# EAGLE design AT42QT1010_Capacitive_Touch_Breakout (EAGLE 7.7.0)
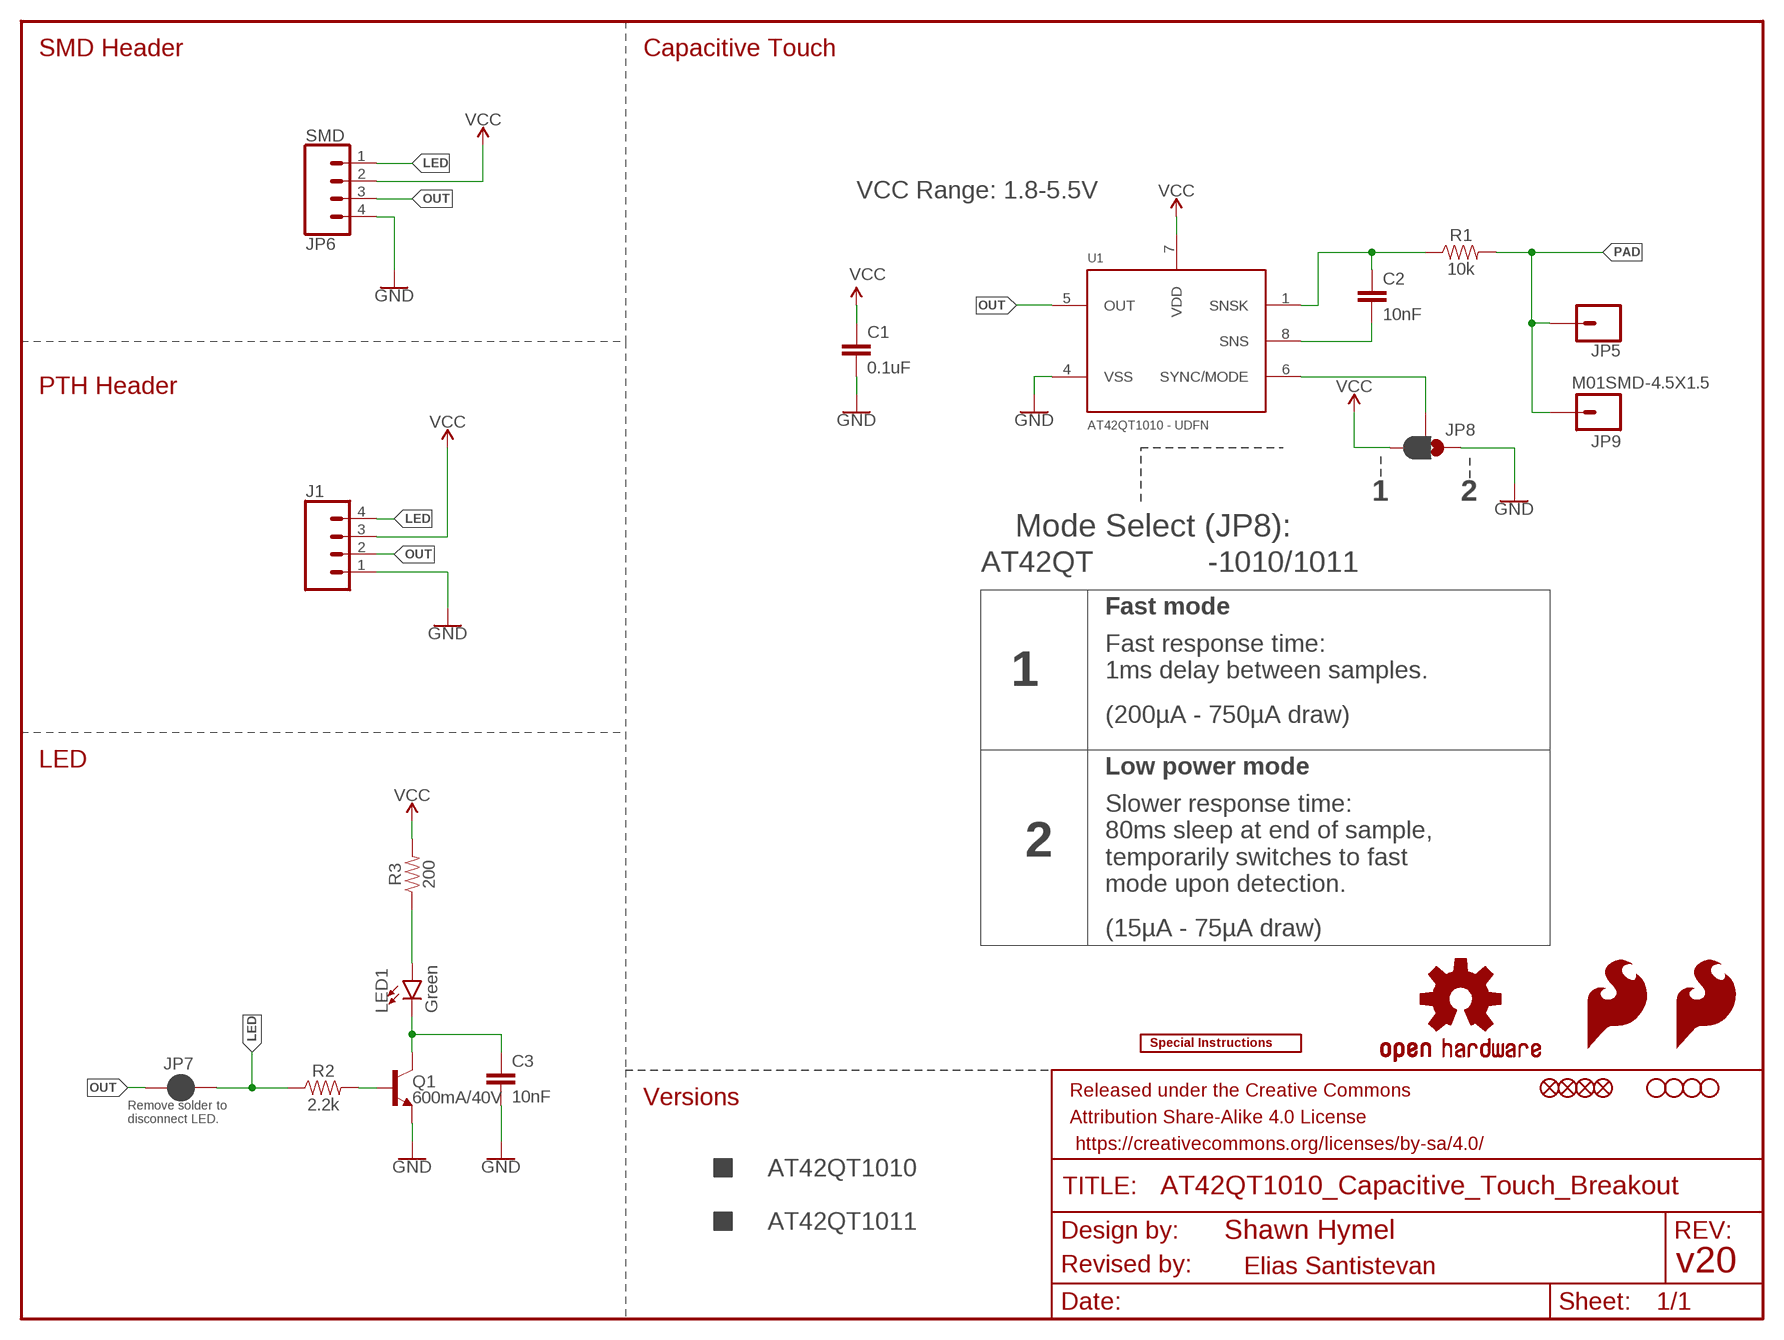
[diagram p0: schematic, sheet 1]

## Parts
C1  0.1uF  0.1UF-0603-25V-(+80/-20%)  [0603]
C2  10nF  10NF-0603-50V-10%  [0603]
C3  10nF  10NF-0603-50V-10%  [0603]
FID1  FIDUCIAL1X2  [FIDUCIAL-1X2]
FID2  FIDUCIAL1X2  [FIDUCIAL-1X2]
FID3  FIDUCIAL1X2  [FIDUCIAL-1X2]
FID4  FIDUCIAL1X2  [FIDUCIAL-1X2]
FRAME1  FRAME-LETTER  [CREATIVE_COMMONS]
J1  CONN_04  [1X04]
JP5  CONN_01  [1X01]
JP6  SMD  CONN_04SMD  [1X04_SMD_RA_MALE]
JP7  JUMPER-SMT_2_NC_PASTE_SILK  [SMT-JUMPER_2_NC_PASTE_SILK]
JP8  JUMPER-SMT_3_1-NC_PASTE_SILK  [SMT-JUMPER_3_1-NC_PASTE_SILK]
JP9  M01SMD-4.5X1.5  [PAD-1.5X4.5]
LED1  Green  LED-GREEN1206-BOTTOM  [LED-1206-BOTTOM]
LOGO1  SFE_LOGO_FLAME.2_INCH  [SFE_LOGO_FLAME_.2]
LOGO2  OSHW-LOGOS  [OSHW-LOGO-S]
LOGO4  SFE_LOGO_FLAME.2_INCH  [SFE_LOGO_FLAME_.2]
Q1  600mA/40V  TRANS_NPN-MMBT2222AL  [SOT23-3]
R1  10k  10KOHM-0603-1/10W-1%  [0603]
R2  2.2k  2.2KOHM-0603-1/10W-1%  [0603]
R3  200  200OHM-0603-1/10W-1%  [0603]
STANDOFF1  STAND-OFF  [STAND-OFF]
STANDOFF2  STAND-OFF  [STAND-OFF]
STANDOFF3  STAND-OFF  [STAND-OFF]
STANDOFF4  STAND-OFF  [STAND-OFF]
U1  AT42QT1010 - UDFN  AT42QT1010UDFN  [UDFN/USON_8_PAD]
U$1  SPECIAL_INSTRUCTIONS-ORDERING  [ORDERING_INSTRUCTIONS]

## Nets
GND: C1.2 C3.2 J1.1 JP6.4 JP8.1 Q1.2(E) U1.4(VSS)
LED: J1.4 JP6.1 JP7.2 R2.1
N$3: JP8.2 U1.6(SYNC/MODE)
N$4: C2.2 U1.8(SNS)
N$5: C2.1 R1.1 U1.1(SNSK)
N$10: Q1.1(B) R2.2
N$11: C3.1 LED1.C Q1.3(C)
N$12: LED1.A R3.1
OUT: J1.2 JP6.3 JP7.1 U1.5(OUT)
PAD: JP5.1 JP9.P$1 R1.2
VCC: C1.1 J1.3 JP6.2 JP8.3 R3.2 U1.7(VDD)

## Notes on the sheet
- SMD Header | Capacitive Touch
- VCC Range: 1.8-5.5V
- PTH Header
- 1 | 2
- Mode Select (JP8):
- AT42QT | -1010/1011
- Fast mode
- Fast response time:
  1ms delay between samples.
- 1
- (200µA - 750µA draw)
- LED | Low power mode
- 2
- Slower response time:
  80ms sleep at end of sample,
  temporarily switches to fast 
  mode upon detection.
- (15µA - 75µA draw)
- Versions
- Remove solder to 
  disconnect LED.
- AT42QT1010
- AT42QT1011
- Shawn Hymel
- Revised by: | Elias Santistevan | v20

## Library data of the parts
C1 = SparkFun-Capacitors:0.1UF: 0.1µF ceramic capacitors A capacitor is a passive two-terminal electrical component used to store electrical energy temporarily in an electric field.; PROD_ID: CAP-00810
C2 C3 = SparkFun-Capacitors:10NF: 0.01uF/10nF/10,000pF ceramic capacitors A capacitor is a passive two-terminal electrical component used to store electrical energy temporarily in an electric field. CAP-09321; PROD_ID: CAP-00867
FID1-FID4 = SparkFun-Aesthetics:FIDUCIAL: Fiducial Alignment Points Various fiducial points for machine vision alignment.
FRAME1 = SparkFun-Aesthetics:FRAME-LETTER: Schematic Frame - Letter Standard 8.5x11 US Letter frame
J1 = SparkFun-Connectors:CONN_04: Multi connection point. Often used as Generic Header-pin footprint for 0.1 inch spaced/style header connections On any of the 0.1 inch spaced packages, you can populate with these: Break Away Headers - Straight <https://www.sparkfun.com/products/116> (PRT-00116) Break Away Male Headers - Right Angle <https://www.sparkfun.com/products/553> (PRT-00553) Female Headers <https://www.sparkfun.com/products/115> (PRT-00115) Break Away Headers - Machine Pin <https://www.sparkfun.com/products/117> (PRT-00117) Break Away Female Headers - Swiss Machine Pin <https://www.sparkfun.com/products/743> (PRT-00743) For SCREWTERMINALS and SPRING TERMINALS visit here: Screw Terimnals on SparkFun.com <https://www.sparkfun.com/search/results?term=Screw+Terminals> (5mm/3.5mm/2.54mm spacing) This device is also useful as a general connection point to wire up your design to another part of your project. Our various solder wires solder well into these plated through hole pads. Hook-Up Wire - Assortment (Stranded, 22 AWG) <https://www.sparkfun.com/products/11375> (PRT-11375) Hook-Up Wire - Assortment (Solid Core, 22 AWG) <https://www.sparkfun.com/products/11367> (PRT-11367) View the entire wire category on our website here <https://www.sparkfun.com/categories/141> Special notes: Molex polarized connector foot print use with SKU : PRT-08231 with associated crimp pins and housings. 1MM SMD Version SKU: PRT-10208; PROD_ID: CONN-09696
JP5 = SparkFun-Connectors:CONN_01: Single connection point. Often used as Generic Header-pin footprint for 0.1 inch spaced/style header connections On any of the 0.1 inch spaced packages, you can populate with these: Break Away Headers - Straight <https://www.sparkfun.com/products/116> (PRT-00116) Break Away Male Headers - Right Angle <https://www.sparkfun.com/products/553> (PRT-00553) Female Headers <https://www.sparkfun.com/products/115> (PRT-00115) Break Away Headers - Machine Pin <https://www.sparkfun.com/products/117> (PRT-00117) Break Away Female Headers - Swiss Machine Pin <https://www.sparkfun.com/products/743> (PRT-00743) This device is also useful as a general connection point to wire up your design to another part of your project. Our various solder wires solder well into these plated through hole pads. Hook-Up Wire - Assortment (Stranded, 22 AWG) <https://www.sparkfun.com/products/11375> (PRT-11375) Hook-Up Wire - Assortment (Solid Core, 22 AWG) <https://www.sparkfun.com/products/11367> (PRT-11367) View the entire wire category on our website here <https://www.sparkfun.com/categories/141> Special notes: SMTSO-256-ET is a "flush mount" nut for a 4-40 screw. We mostly use this on specialty testbeds; it is a nice way to connect hardware to your PCB at an adjustable hieght. Also note, the SNAP packages are for using a snappable style connector. We sell a baggie of snaps and they are also used on two LilyPad designs: Snap Assortment - 30 pack (male and female) <https://www.sparkfun.com/products/11347> (DEV-11347) LilyPad Arduino SimpleSnap <https://www.sparkfun.com/products/10941> (DEV-10941) LilyPad SimpleSnap Protoboard <https://www.sparkfun.com/products/10940> (DEV-10940)
JP6 = SparkFun-Connectors:CONN_04: Multi connection point. Often used as Generic Header-pin footprint for 0.1 inch spaced/style header connections On any of the 0.1 inch spaced packages, you can populate with these: Break Away Headers - Straight <https://www.sparkfun.com/products/116> (PRT-00116) Break Away Male Headers - Right Angle <https://www.sparkfun.com/products/553> (PRT-00553) Female Headers <https://www.sparkfun.com/products/115> (PRT-00115) Break Away Headers - Machine Pin <https://www.sparkfun.com/products/117> (PRT-00117) Break Away Female Headers - Swiss Machine Pin <https://www.sparkfun.com/products/743> (PRT-00743) For SCREWTERMINALS and SPRING TERMINALS visit here: Screw Terimnals on SparkFun.com <https://www.sparkfun.com/search/results?term=Screw+Terminals> (5mm/3.5mm/2.54mm spacing) This device is also useful as a general connection point to wire up your design to another part of your project. Our various solder wires solder well into these plated through hole pads. Hook-Up Wire - Assortment (Stranded, 22 AWG) <https://www.sparkfun.com/products/11375> (PRT-11375) Hook-Up Wire - Assortment (Solid Core, 22 AWG) <https://www.sparkfun.com/products/11367> (PRT-11367) View the entire wire category on our website here <https://www.sparkfun.com/categories/141> Special notes: Molex polarized connector foot print use with SKU : PRT-08231 with associated crimp pins and housings. 1MM SMD Version SKU: PRT-10208; PROD_ID: CONN-09140; SF_ID: PRT-12638
JP7 = SparkFun-Jumpers:JUMPER-SMT_2_NC_PASTE: Normally closed solder jumper This jumper has an aperture in the stencil to allow solder paste to bridge the split in the wire so it's normally closed (NC). Wick off the solder to open the connection. Reapply solder to reclose the connection.
JP8 = SparkFun-Jumpers:JUMPER-SMT_3_1-NC_PASTE: Normally closed solder jumper (1 of 2 connections) This jumper has an aperture in the stencil to allow solder paste to bridge one of the two connections. One connection is normally closed (NC), while the other is normally open (NO). Wick off the solder to open the connection. Reapply solder to reclose the connection. Apply solder to the other side instead to change the current path.
JP9 = SparkFun-Connectors:M01: Header 1 Standard 1-pin 0.1" header. Use with straight break away headers (SKU : PRT-00116), right angle break away headers (PRT-00553), swiss pins (PRT-00743), machine pins (PRT-00117), and female headers (PRT-00115).
LED1 = SparkFun-LED:LED-GREEN: Green SMD LED Used in manufacturing of various products at SparkFun Packages: 0603 - SMD 0603 package [Product Link] <http://www.futureelectronics.com/en/technologies/semiconductors/optoelectronics/leds/Pages/9894312-LTST-C190GKT.aspx?CrossPart=HSMG-C190&IM=0> LilyPad 1206 - SMD1206 LilyPad package [Product Link] <http://www.futureelectronics.com/en/Technologies/Product.aspx?ProductID=IN150NGHARVATEKCORPORATION2049943&IM=0> 1206 - SMD1206 package [Product Link] <http://www.futureelectronics.com/en/technologies/semiconductors/optoelectronics/leds/Pages/8315665-LTST-C150KGKT.aspx?IM=0> 1206 Bottom Mount -SMD 1206 Bottom Mount [Product Link] <http://www.digikey.com/product-detail/en/lite-on-inc/LTST-C230KGKT/160-1456-1-ND/386854> SparkFun Products: Pro Mini 328 -5V <https://www.sparkfun.com/products/821> RedBoard <https://www.sparkfun.com/products/12757> MP3 Trigger <https://www.sparkfun.com/products/13720> Makey Makey <https://www.sparkfun.com/products/11076>; PROD_ID: DIO-11076
LOGO1 LOGO4 = SparkFun-Aesthetics:SFE_LOGO_FLAME: SparkFun Flame Logo This is the SparkFun flame logo. The logo on the schematic will always be the same size; the package variant is the height of the flame. Default layer for the logo on the board is tSilk.
LOGO2 = SparkFun-Aesthetics:OSHW-LOGO: Open Source Hardware Logo This logo indicates the piece of hardware it is found on incorporates a OSHW license and/or adheres to the definition of open source hardware found here: http://freedomdefined.org/OSHW
Q1 = SparkFun-DiscreteSemi:TRANS_NPN: NPN transistor Current controlled devices typically used to amplify current or used as a switch. BC547 - COM-08928 <http://www.sparkfun.com/products/8928> (TO-92 45V 100mA) (1.Collector 2.Base 3.Emitter) 2N3904 - COM-00521 <http://www.sparkfun.com/products/521> (TO-92 40V 200mA) (1.Emitter 2.Base 3.Collector) P2N2222A - COM-12852 <http://www.sparkfun.com/products/12852> (TO-92 40V 600mA) (1.Collector 2.Base 3.Emitter); PROD_ID: TRANS-08049
R1 = SparkFun-Resistors:10KOHM: 10kΩ resistor A resistor is a passive two-terminal electrical component that implements electrical resistance as a circuit element. Resistors act to reduce current flow, and, at the same time, act to lower voltage levels within circuits. - Wikipedia; PROD_ID: RES-00824
R2 = SparkFun-Resistors:2.2KOHM: 2.2kΩ resistor A resistor is a passive two-terminal electrical component that implements electrical resistance as a circuit element. Resistors act to reduce current flow, and, at the same time, act to lower voltage levels within circuits. - Wikipedia; PROD_ID: RES-08272
R3 = SparkFun-Resistors:200OHM: 200Ω resistor A resistor is a passive two-terminal electrical component that implements electrical resistance as a circuit element. Resistors act to reduce current flow, and, at the same time, act to lower voltage levels within circuits. - Wikipedia; PROD_ID: RES-08220
STANDOFF1-STANDOFF4 = SparkFun-Hardware:STAND-OFF: Stand Off Drill holes for mechanically mounting via screws, standoffs, etc. Note: Use the keepout ring to avoid running the screw head into surrounding components. Variant Overviews STAND-OFF - Mechanical footprint for a #4 phillips button head screw. STAND-OFF-TIGHT - Mechanical footprint for a #4 phillips button head screw, Example SparkFun Products Screw - Phillips Head (1/4", 4-40, 10 pack) <https://www.sparkfun.com/products/10453> (PRT-10453) Screw - Phillips Head (1/2", 4-40, 10 pack) <https://www.sparkfun.com/products/10452> (PRT-10452) Screw - Phillips Head (3/4", 4-40, 10 pack) <https://www.sparkfun.com/products/10451> (PRT-10451) Screw - Phillips Head (1", 4-40, 10 pack) <https://www.sparkfun.com/products/10450> (PRT-10450)
U1 = local_parts:AT42QT1010: Atmel AT42QT1010 The AT42QT1010 (QT1010) is a digital burst mode charge-transfer (QT™) sensor that is capable of detecting nearproximityor touch, making it ideal for implementing touch controls.The QT1010 is designed specifically for human interfaces, like control panels, appliances, toys, lighting controls, or anywhere a mechanical switch or button may be found. It includes all hardware and signal processing functions necessary to provide stable sensing under a wide variety of changing conditions. Only a single low-cost capacitor is required for operation. This chip is identical to the AT42QT1011, however the capsense times out after 60 seconds. Reciprocally, the capsense on the 1011 never times out. Reference "Signal Processing" in the datasheet. Datasheet <http://www.atmel.com/images/Atmel-9541-AT42-QTouch-BSW-AT42QT1010_Datasheet.pdf> Sparkfun Products Sparkfun Capacitive Touch Breakout <https://www.sparkfun.com/products/12041> (SEN-12041); PROD_ID: IC-13773
U$1 = SparkFun-Aesthetics:SPECIAL_INSTRUCTIONS: Special Ordering/Production Instructions Alert Symbol for special PCB ordering instructions or unique production process warnings. Ordering Instructions Production Instructions Types of information that should be added to box: Copper weight Soldermask color Silk color PCB thickness Number of layers PCB Standard: 1.6mm FR4 1 oz copper immersion silver plating red soldermask white silkscreen Types of information that should be added to box: Special wash requirements Depaneling instructions Humidification Glue curing Default text settings: 0.07 inch 9% ratio 50% line distance

## Net classes
0 default: clearance 0.205 mm

## Board
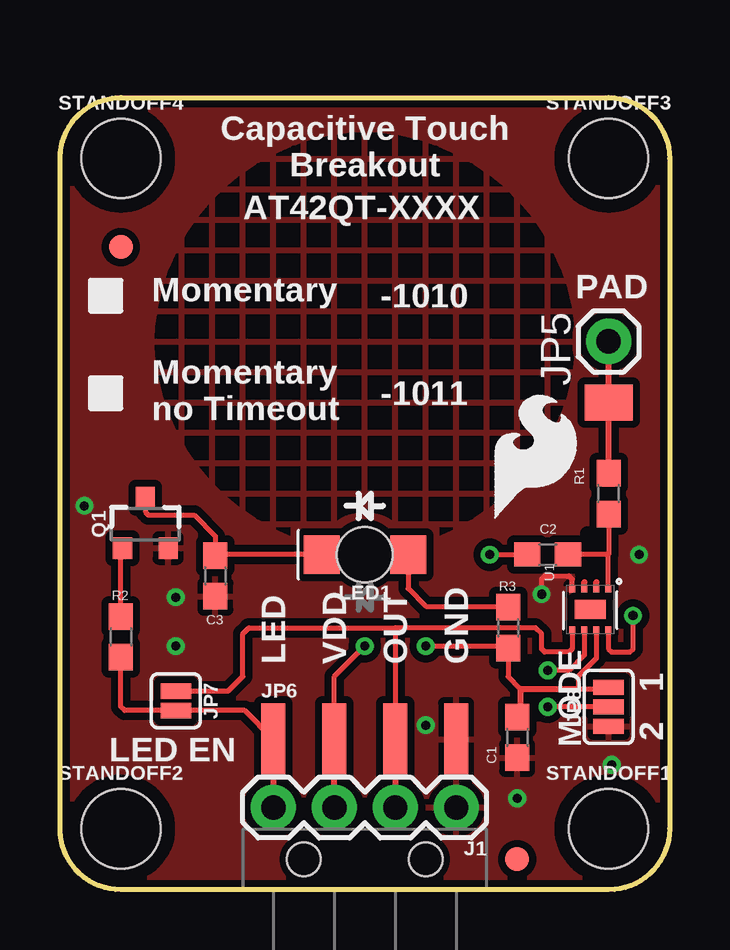
[diagram p1: board, top side]
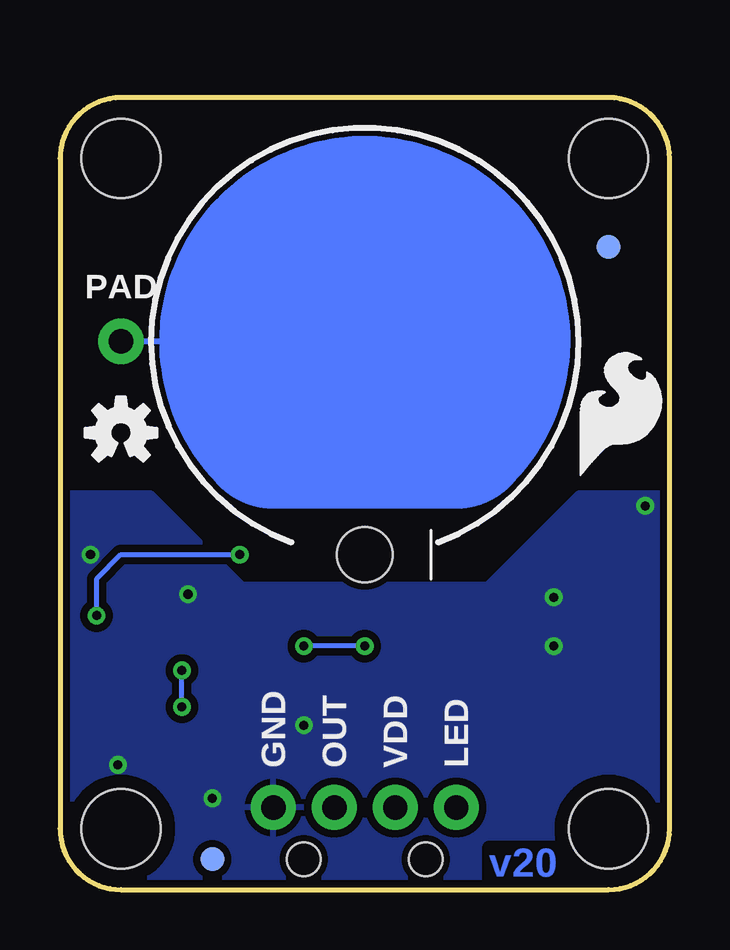
[diagram p2: board, bottom side, seen from below]

Size 25.4 x 33.02 mm. Coordinates in mm from the lower left corner, seen from the top.
Outline: 0,2.54 0,30.48 arc-90 2.54,33.02 22.86,33.02 arc-90 25.4,30.48 25.4,2.54 arc-90 22.86,0 2.54,0 arc-90 0,2.54
Copper layers (1*16): Top 0.035mm / dielectric 1.5mm / Bottom 0.035mm
Design rules "SparkFun-2-layer-TIGHT": minimum track width 7mil, minimum drill 15mil, track to track 7mil, track to pad 7mil, pad to pad 7mil, via to via 7mil, smd to smd 7mil, copper to edge 7mil, drill to drill 7mil, minimum pad ring 7mil, minimum via ring 7mil, stop-mask expansion 4mil, vias tented up to drill 25mil, thermal gap 10mil
tRestrict: area 0,0 to 2.5,2.5; area 22.9,0 to 25.4,2.5; area 0,30.5 to 2.5,33; area 22.9,30.5 to 25.4,33; area 15,2.3 to 15.5,2.8; area 9.9,2.3 to 10.4,2.8; area 11.2,0.5 to 14.2,2; area 12.4,2.3 to 13,2.8; area 19.4,9 to 19.8,9.5; area 22.1,13.1 to 22.5,13.6; area 22,14.4 to 22.4,14.9

### Footprints (pad centres in the part's own frame; a part is rotated, then mirrored left to right if it is on the bottom)
0603 = smd 1.1 x 1: 1 -0.85,0; 2 0.85,0
FIDUCIAL-1X2 = smd 1 x 1: 1 0,0
1X04 = drill 1.016 pad 1.88: 1 0,0; 2 2.54,0; 3 5.08,0; 4 7.62,0
1X01 = drill 1.016 pad 1.88: 1 0,0
1X04_SMD_RA_MALE = smd 1 x 3: 1 -3.81,5; 2 -1.27,5; 3 1.27,5; 4 3.81,5 | hole 1.4: -2.54,0; 2.54,0
SMT-JUMPER_2_NC_PASTE_SILK = smd 0.635 x 1.27: 1 -0.406,0; 2 0.406,0
SMT-JUMPER_3_1-NC_PASTE_SILK = smd 0.635 x 1.27: 1 -0.813,0; 2 0,0; 3 0.813,0
PAD-1.5X4.5 = smd 1.5 x 2: P$1 0,0
LED-1206-BOTTOM = smd 1.5 x 1.6: A -1.8,0; C 1.8,0 | hole 2.3: 0,0
SOT23-3 = smd 0.8 x 0.9: 1 -0.95,-1; 2 0.95,-1; 3 0,1.1
STAND-OFF = hole 3.302: 0,0
UDFN/USON_8_PAD = smd 0.25 x 0.3: 1 -0.75,-0.852; 2 -0.25,-0.852; 3 0.25,-0.852; 4 0.75,-0.852; 5 0.75,0.852; 6 0.25,0.852; 7 -0.25,0.852; 8 -0.75,0.852 | smd 1.3 x 0.8: P$1 0,0

### Placement (x,y rotation side)
C1  19.05,6.35 270 top
C2  20.32,13.97 180 top
C3  6.48,13.08 270 top
FID1  2.54,26.8 0 top
FID2  19.05,1.27 0 top
FID3  19.05,1.27 0 bottom
FID4  2.54,26.8 0 bottom
FRAME1  -15.24,-17.78 0 top  (outside the outline)
J1  16.51,3.43 180 top
JP5  22.86,22.86 0 top
JP6  12.7,1.27 0 top
JP7  4.83,7.87 270 top
JP8  22.86,7.62 90 top
JP9  22.86,20.32 90 top
LED1  12.7,13.97 180 top
LOGO1  17.78,15.24 0 top
LOGO2  22.86,19.05 0 bottom
LOGO4  4.06,17.02 0 bottom
Q1  3.56,15.24 0 top
R1  22.86,16.51 90 top
R2  2.54,10.54 90 top
R3  18.67,10.92 270 top
STANDOFF1  22.86,2.54 0 top
STANDOFF2  2.54,2.54 0 top
STANDOFF3  22.86,30.48 0 top
STANDOFF4  2.54,30.48 0 top
U1  22.1,11.68 180 top
U$1  -35.56,-21.59 0 top  (outside the outline)

### Tracks (layer width: path | path; a pad name or v marks a point on that pad's centre or on a via)
GND  (via drill 0.38)
  Top 0.203: U1.4 21.35,12.94 21.21,13.08 20.19,13.08 20.07,12.95 v20.07,12.32
  other vias: 19.05,3.81 1.02,16 24.13,13.97 4.83,12.19 4.83,10.16 22.99,5.21 15.24,6.86
  pour Bottom (isolate 0.305): 0,0 0,16.51 3.81,16.51 7.62,12.7 17.78,12.7 21.59,16.51 25.4,16.51 25.4,0
  pour Top (isolate 0.305): 0,0 25.4,0 25.4,22.86 21.59,22.86 arc-90 12.7,13.97 arc-90 3.81,22.86 0,22.86
  pour Top (isolate 0.305, hatched): 3.81,22.86 arc-90 12.7,31.75 arc-90 21.59,22.86 arc-90 12.7,13.97 arc-90
  pour Top (isolate 0.305): 3.81,22.86 arc-90 12.7,31.75 arc-90 21.59,22.86 25.4,22.86 25.4,33.02 0,33.02 0,22.86
LED
  Top 0.203: 4.67,7.62 JP7.2 | JP7.2 2.69,7.47 2.54,7.62 R2.1 | JP6.1 7.69,7.47 JP7.2
  Top 0.254: JP6.1 J1.4
  Bottom 0.254: 8.89,3.81 J1.4
N$1
  Top 0.254: 21.84,12.57 21.84,12.83
N$2
  Top 0.254: 22.35,12.57 22.35,12.83
N$3  (via drill 0.38)
  Top 0.203: U1.6 21.84,9.78 21.21,9.14 v20.32,9.14 | JP8.2 v20.32,7.62
  Bottom 0.203: v20.32,7.62 v20.32,9.14
N$4  (via drill 0.38)
  Top 0.203: v17.91,13.97 C2.2 | U1.8 22.85,10.04 22.99,9.91 23.75,9.91 23.88,10.03 v23.88,11.43
  Top 0.254: C2.2 19.56,13.97
  Bottom 0.203: v17.91,13.97 22.86,13.97 23.88,12.95 v23.88,11.43
N$5
  Top 0.203: 22.86,13.97 C2.1 | R1.1 22.86,13.97 | U1.1 22.85,13.96 22.86,13.97
N$10
  Top 0.203: R2.2 2.54,14.17 Q1.1
N$11
  Top 0.203: LED1.C 6.52,13.97 C3.1 6.48,14.73 5.59,15.62 3.68,15.62 3.56,15.75 Q1.3
N$12
  Top 0.203: 18.67,11.81 R3.1 18.63,11.81 15.24,11.81 14.5,12.55 LED1.A
OUT
  Top 0.203: JP7.1 7.01,8.28 7.62,8.89 7.62,10.67 7.87,10.92 13.97,10.92 | 13.97,10.92 JP6.3 | 13.97,10.92 19.81,10.92 20.07,10.67 20.07,10.03 20.19,9.91 21.21,9.91 21.35,10.04 U1.5
  Top 0.254: JP6.3 J1.2
PAD
  Top 0.254: JP5.1 JP9.P$1 R1.2
  Bottom 0.254: 12.7,22.86 16.51,19.05 19.05,19.05 19.05,17.53 18.8,17.27 18.54,17.27 | 8.89,22.86 8.89,19.05 | 12.78,22.86 12.65,22.99 | 12.95,22.86 JP5.1
  Bottom 6.35: 12.7,22.86 12.78,22.86 12.95,22.86 16.51,22.86 | 8.89,19.05 arc-270 16.51,19.05 8.89,19.05
VCC  (via drill 0.38)
  Top 0.203: JP6.2 11.43,8.89 v12.7,10.16 | v15.24,10.16 18.58,10.16 R3.2 18.67,8.89 19.18,8.38 | U1.7 22.35,9.65 21.59,8.89 21.59,8.38 22.86,8.38 JP8.3
  Top 0.254: C1.1 19.18,7.33 19.18,8.38 21.59,8.38 | J1.3 JP6.2
  Bottom 0.203: v12.7,10.16 v15.24,10.16

### Text on the board
Bottom: v20
tPlace: AT42QT-XXXX | Capacitive Touch / Breakout | Momentary | PAD | -1010 | Momentary / no Timeout | -1011 | LED | VDD | OUT | GND | 1 | MODE | 2 | LED EN
bPlace: PAD | LED | VDD | OUT | GND
Measures: Dimensions given are in inches.
tDocu: Shawn Hymel | Revised by: | Elias Santistevan | The 0.09055118 in. (2.3mm) hole is NPTH hole